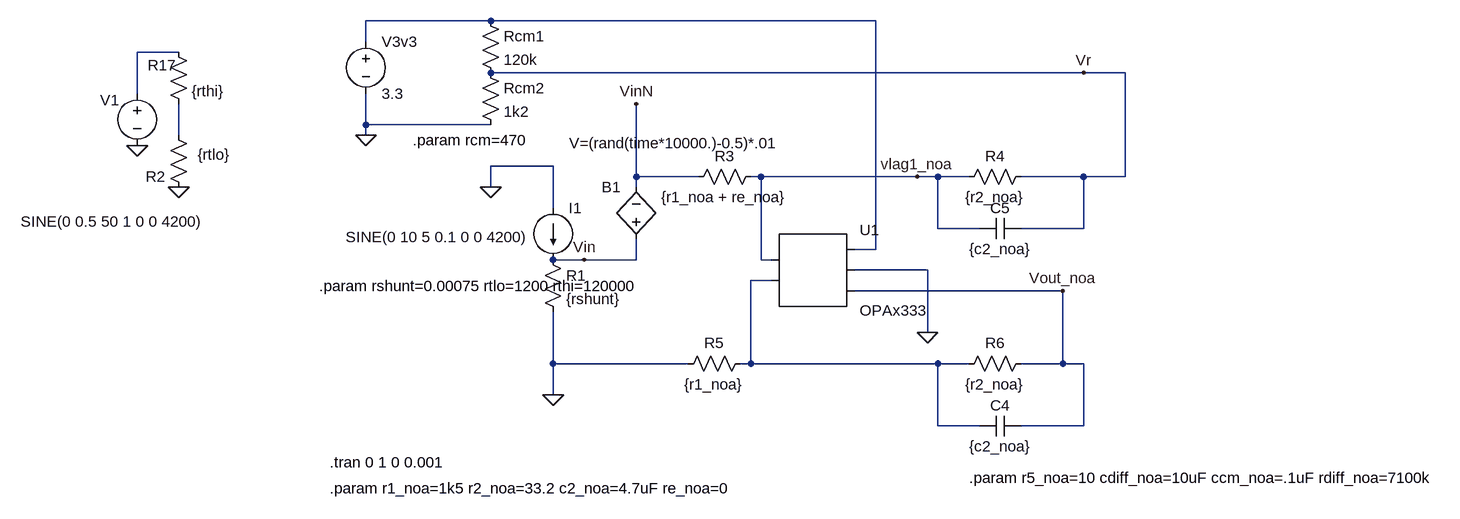
[diagram p0: schematic opa333_bipolar.asc]
opa333_bipolar.asc, the LTspice schematic file:
Version 4.1
SHEET 1 2568 680
WIRE -320 -224 -512 -224
WIRE 272 -224 -320 -224
WIRE -512 -192 -512 -224
WIRE -800 -176 -864 -176
WIRE 592 -144 -320 -144
WIRE 656 -144 592 -144
WIRE -864 -112 -864 -176
WIRE -512 -64 -512 -112
WIRE -320 -64 -512 -64
WIRE -800 -48 -800 -96
WIRE -512 -48 -512 -64
WIRE -224 0 -320 0
WIRE -96 16 -96 -96
WIRE 0 16 -96 16
WIRE 96 16 80 16
WIRE 336 16 96 16
WIRE 368 16 336 16
WIRE 416 16 368 16
WIRE 592 16 496 16
WIRE 656 16 656 -144
WIRE 656 16 592 16
WIRE -320 32 -320 0
WIRE -96 32 -96 16
WIRE -224 64 -224 0
WIRE 368 96 368 16
WIRE 432 96 368 96
WIRE 592 96 592 16
WIRE 592 96 496 96
WIRE 272 128 272 -224
WIRE 272 128 240 128
WIRE -176 144 -224 144
WIRE -96 144 -96 112
WIRE -96 144 -176 144
WIRE 96 144 96 16
WIRE 112 144 96 144
WIRE 352 160 240 160
WIRE 112 176 80 176
WIRE 560 192 240 192
WIRE 352 256 352 160
WIRE -224 304 -224 224
WIRE -16 304 -224 304
WIRE 80 304 80 176
WIRE 80 304 64 304
WIRE 368 304 80 304
WIRE 416 304 368 304
WIRE 560 304 560 192
WIRE 560 304 496 304
WIRE 592 304 560 304
WIRE -224 352 -224 304
WIRE 368 400 368 304
WIRE 432 400 368 400
WIRE 592 400 592 304
WIRE 592 400 496 400
FLAG 352 256 0
FLAG -320 32 0
FLAG -512 -48 0
FLAG -224 352 0
FLAG -176 144 Vin
FLAG 336 16 vlag1_noa
FLAG 560 192 Vout_noa
FLAG -800 32 0
FLAG -864 -32 0
FLAG -96 -96 VinN
FLAG 592 -144 Vr
SYMBOL Autogenerated\\OPAx333 176 160 R0
SYMATTR InstName U1
SYMBOL voltage -512 -208 R0
WINDOW 123 0 0 Left 0
WINDOW 39 0 0 Left 0
SYMATTR InstName V3v3
SYMATTR Value 3.3
SYMBOL res -336 -240 R0
SYMATTR InstName Rcm1
SYMATTR Value 120k
SYMBOL res -336 -160 R0
SYMATTR InstName Rcm2
SYMATTR Value 1k2
SYMBOL res -240 128 R0
SYMATTR InstName R1
SYMATTR Value {rshunt}
SYMBOL res 96 0 R90
WINDOW 0 0 56 VBottom 2
WINDOW 3 32 56 VTop 2
SYMATTR InstName R3
SYMATTR Value {r1_noa + re_noa}
SYMBOL res 512 0 R90
WINDOW 0 0 56 VBottom 2
WINDOW 3 32 56 VTop 2
SYMATTR InstName R4
SYMATTR Value {r2_noa}
SYMBOL res 80 288 R90
WINDOW 0 0 56 VBottom 2
WINDOW 3 32 56 VTop 2
SYMATTR InstName R5
SYMATTR Value {r1_noa}
SYMBOL res 512 288 R90
WINDOW 0 0 56 VBottom 2
WINDOW 3 32 56 VTop 2
SYMATTR InstName R6
SYMATTR Value {r2_noa}
SYMBOL current -224 64 R0
WINDOW 3 -319 45 Left 2
WINDOW 123 0 0 Left 0
WINDOW 39 0 0 Left 0
SYMATTR Value SINE(0 10 5 0.1 0 0 4200)
SYMATTR InstName I1
SYMBOL cap 496 384 R90
WINDOW 0 0 32 VBottom 2
WINDOW 3 32 32 VTop 2
SYMATTR InstName C4
SYMATTR Value {c2_noa}
SYMBOL cap 496 80 R90
WINDOW 0 0 32 VBottom 2
WINDOW 3 32 32 VTop 2
SYMATTR InstName C5
SYMATTR Value {c2_noa}
SYMBOL voltage -864 -128 R0
WINDOW 3 -179 213 Left 2
WINDOW 123 0 0 Left 0
WINDOW 39 0 0 Left 0
WINDOW 0 -57 26 Left 2
SYMATTR Value SINE(0 0.5 50 1 0 0 4200)
SYMATTR InstName V1
SYMBOL res -816 -64 R0
WINDOW 3 45 46 Left 2
WINDOW 0 -35 80 Left 2
SYMATTR Value {rtlo}
SYMATTR InstName R2
SYMBOL bv -96 128 R180
WINDOW 0 24 96 Left 2
WINDOW 3 -222 164 Left 2
SYMATTR InstName B1
SYMATTR Value V=(rand(time*10000.)-0.5)*.01
SYMBOL res -816 -192 R0
WINDOW 0 -32 36 Left 2
SYMATTR InstName R17
SYMATTR Value {rthi}
TEXT -568 456 Left 2 !.tran 0 1 0 0.001
TEXT -584 184 Left 2 !.param rshunt=0.00075 rtlo=1200 rthi=120000
TEXT -568 496 Left 2 !.param r1_noa=1k5 r2_noa=33.2 c2_noa=4.7uF re_noa=0
TEXT 416 480 Left 2 !.param r5_noa=10 cdiff_noa=10uF ccm_noa=.1uF rdiff_noa=7100k
TEXT -440 -40 Left 2 !.param rcm=470

The netlist it stands for:
* opa333_bipolar.asc
* U1: OPAx333 (symbol Autogenerated\OPAx333 not available, pins judged from their places): pin1=vlag1_noa pin2=N004 pin3=N001 pin4=0 pin5=Vout_noa
V3v3 N001 0 3.3
Rcm1 N001 Vr 120k
Rcm2 Vr 0 1k2
R1 Vin 0 {rshunt}
R3 vlag1_noa VinN {r1_noa + re_noa}
R4 Vr vlag1_noa {r2_noa}
R5 N004 0 {r1_noa}
R6 Vout_noa N004 {r2_noa}
I1 0 Vin SINE(0 10 5 0.1 0 0 4200)
C4 Vout_noa N004 {c2_noa}
C5 Vr vlag1_noa {c2_noa}
V1 N002 0 SINE(0 0.5 50 1 0 0 4200)
R2 N003 0 {rtlo}
B1 Vin VinN V=(rand(time*10000.)-0.5)*.01
R17 N002 N003 {rthi}
.tran 0 1 0 0.001
.param rshunt=0.00075 rtlo=1200 rthi=120000
.param r1_noa=1k5 r2_noa=33.2 c2_noa=4.7uF re_noa=0
.param r5_noa=10 cdiff_noa=10uF ccm_noa=.1uF rdiff_noa=7100k
.param rcm=470
.backanno
.end